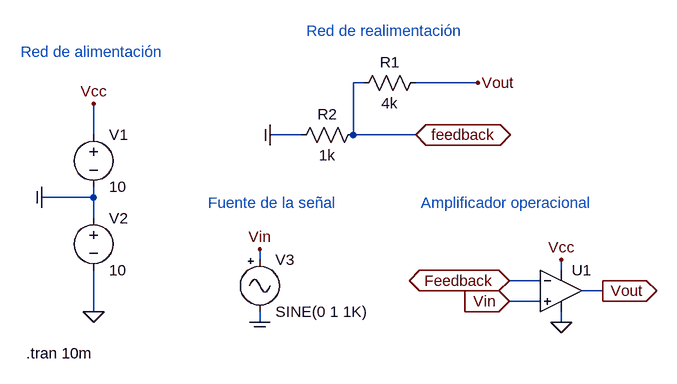
[diagram p0: schematic Ejemplo completo usando redes.asc]
Ejemplo completo usando redes.asc, the LTspice schematic file:
Version 4
SHEET 1 880 680
WIRE 336 80 320 80
WIRE 512 80 416 80
WIRE -80 160 -80 112
WIRE 240 160 192 160
WIRE 320 160 320 80
WIRE 416 160 320 160
WIRE -80 256 -80 240
WIRE -80 256 -160 256
WIRE -80 288 -80 256
WIRE 176 352 176 336
WIRE 640 368 640 352
WIRE 608 384 560 384
WIRE 704 400 672 400
WIRE 608 416 560 416
WIRE -80 432 -80 368
WIRE 176 448 176 432
WIRE 640 448 640 432
FLAG -80 432 0
FLAG -160 256 COM
FLAG 176 448 COM
FLAG -80 112 Vcc
FLAG 640 448 0
FLAG 640 352 Vcc
FLAG 704 400 Vout
IOPIN 704 400 Out
FLAG 560 416 Vin
IOPIN 560 416 In
FLAG 192 160 com
FLAG 560 384 Feedback
IOPIN 560 384 BiDir
FLAG 416 160 feedback
IOPIN 416 160 BiDir
FLAG 512 80 Vout
FLAG 176 336 Vin
SYMBOL voltage -80 144 R0
WINDOW 123 0 0 Left 0
WINDOW 39 0 0 Left 0
SYMATTR InstName V1
SYMATTR Value 10
SYMBOL voltage -80 272 R0
WINDOW 123 0 0 Left 0
WINDOW 39 0 0 Left 0
SYMATTR InstName V2
SYMATTR Value 10
SYMBOL OpAmps\\UniversalOpAmp 640 400 R0
SYMATTR InstName U1
SYMBOL res 432 64 R90
WINDOW 0 0 56 VBottom 2
WINDOW 3 32 56 VTop 2
SYMATTR InstName R1
SYMATTR Value 4k
SYMBOL res 336 144 R90
WINDOW 0 0 56 VBottom 2
WINDOW 3 32 56 VTop 2
SYMATTR InstName R2
SYMATTR Value 1k
SYMBOL Misc\\signal 176 336 R0
WINDOW 123 0 0 Left 0
WINDOW 39 0 0 Left 0
SYMATTR InstName V3
TEXT -184 496 Left 2 !.tran 10m
TEXT -192 32 Left 2 ;Red de alimentación
TEXT 96 264 Left 2 ;Fuente de la señal
TEXT 248 0 Left 2 ;Red de realimentación
TEXT 424 264 Left 2 ;Amplificador operacional

The netlist it stands for:
* Ejemplo completo usando redes.asc
V1 Vcc COM 10
V2 COM 0 10
XU1 Vin Feedback Vcc 0 Vout level1 Avol=1Meg GBW=10Meg Vos=0 En=0 Enk=0 In=0 Ink=0 Rin=500Meg  ; pins In+ In- V+ V- OUT
R1 Vout Feedback 4k
R2 Feedback COM 1k
V3 Vin COM SINE(0 1 1K)
.tran 10m
* Red de alimentación
* Fuente de la señal
* Red de realimentación
* Amplificador operacional
.lib UniversalOpAmp1.lib
.backanno
.end